# Altium schematic sheet Power.SchDoc
size A4
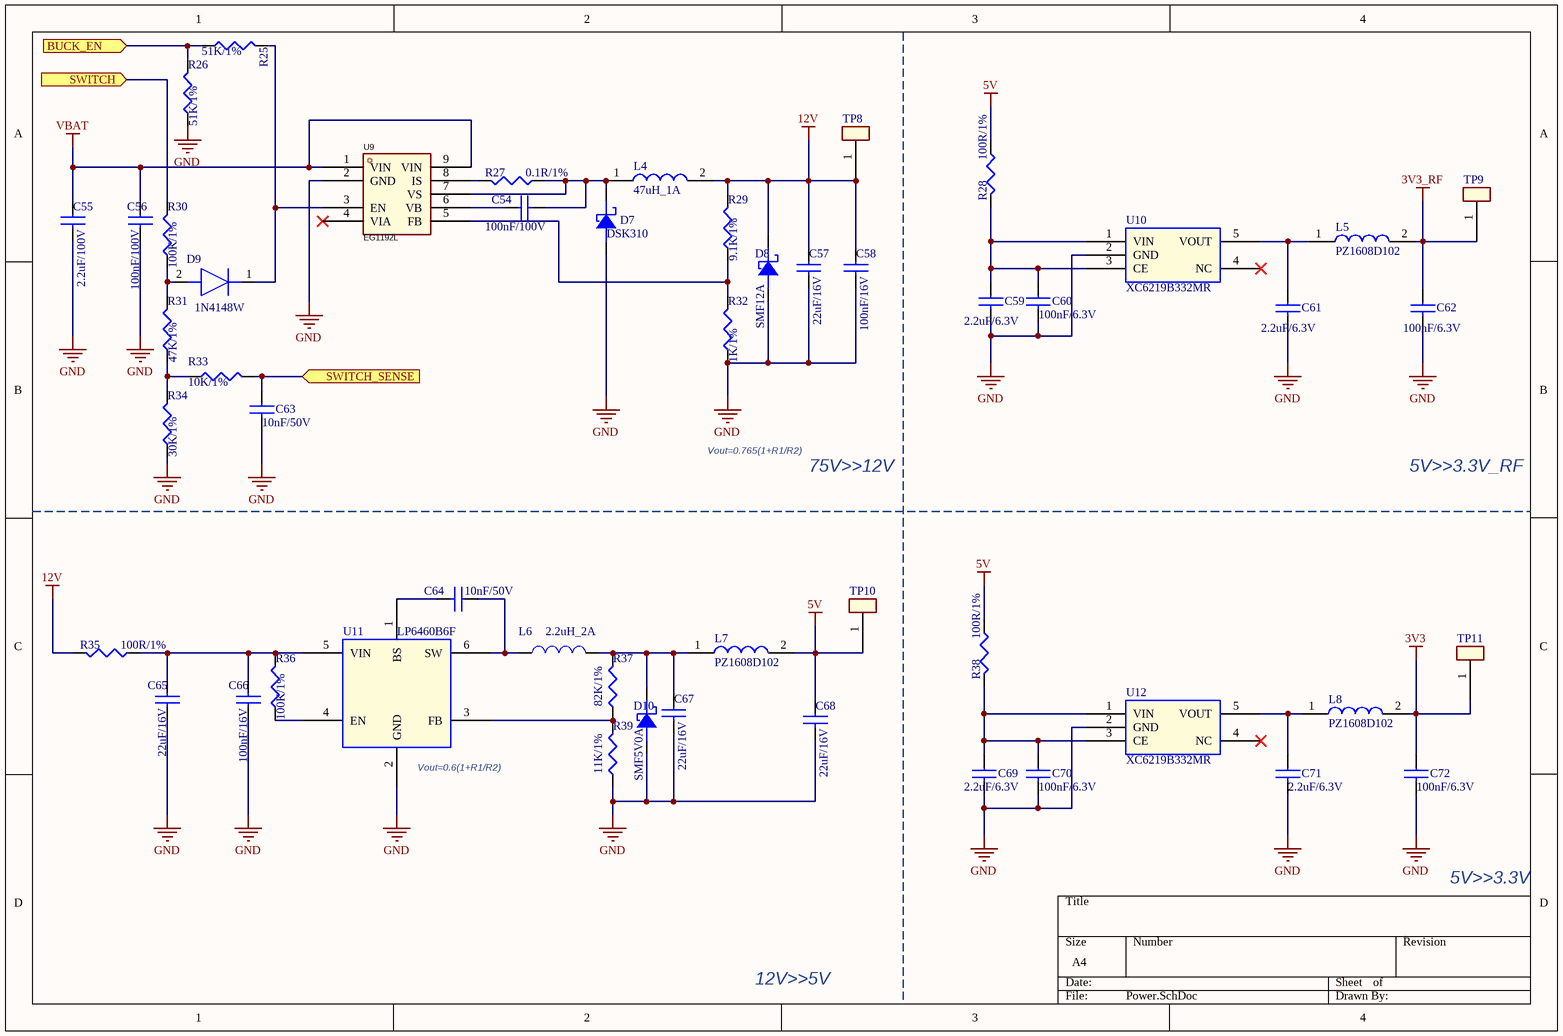
[diagram p0: Power.SchDoc]

## Parts
C54  100nF/100V  [C0603]
C55  2.2uF/100V  [C1206]
C56  100nF/100V  [C0603]
C57  22uF/16V  [C0805]
C58  100nF/16V  [C0805]
C59  2.2uF/6.3V  [C0402]
C60  100nF/6.3V  [C0402]
C61  2.2uF/6.3V  [C0402]
C62  100nF/6.3V  [C0402]
C63  10nF/50V  [C0402]
C64  10nF/50V  [C0402]
C65  22uF/16V  [C0805]
C66  100nF/16V  [C0805]
C67  22uF/16V  [C0805]
C68  22uF/16V  [C0805]
C69  2.2uF/6.3V  [C0402]
C70  100nF/6.3V  [C0402]
C71  2.2uF/6.3V  [C0402]
C72  100nF/6.3V  [C0402]
D7  DSK310  [SOD-123F]
D8  SMF12A  [SOD-123F]
D9  1N4148W  [1N4148WVGS08]
D10  SMF5V0A  [SOD-123F]
L4  47uH_1A  [L5040]
L5  PZ1608D102  [L0603]
L6  2.2uH_2A  [L4020]
L7  PZ1608D102  [L0603]
L8  PZ1608D102  [L0603]
R25  51K/1%  [R0402]
R26  51K/1%  [R0402]
R27  0.1R/1%  [R0603]
R28  100R/1%  [R0603]
R29  9.1K/1%  [R0402]
R30  100K/1%  [R0402]
R31  47K/1%  [R0402]
R32  1K/1%  [R0402]
R33  10K/1%  [R0402]
R34  30K/1%  [R0402]
R35  100R/1%  [R0603]
R36  100K/1%  [R0402]
R37  82K/1%  [R0402]
R38  100R/1%  [R0603]
R39  11K/1%  [R0402]
TP8  TEST POINT  [test_point_100_smd]  (value not drawn)
TP9  TEST POINT  [test_point_100_smd]  (value not drawn)
TP10  TEST POINT  [test_point_100_smd]  (value not drawn)
TP11  TEST POINT  [test_point_100_smd]  (value not drawn)
U9  EG1192L  [ESOP-8_L4.9-W3.9-P1.27-LS6.0-BL-EP-1]
U10  XC6219B332MR  [SOT-23-5]
U11  LP6460B6F  [SOT-23-6]
U12  XC6219B332MR  [SOT-23-5]

## Ports
BUCK_EN (in, see VESC_75100[2C]), SWITCH (in, see VESC_75100[2C]), SWITCH_SENSE (in, see VESC_75100[2C], MCU[1C])

## Nets
3V3: C72.1 L8.2 TP11.1
3V3_RF: C62.1 L5.2 TP9.1
5V: C68.1 L7.2 R28.1 R38.1 TP10.1
12V: C57.1 C58.1 D8.1(K) L4.2 R29.2 R35.2 TP8.1
GND: C55.2 C56.2 C57.2 C58.2 C59.2 C60.2 C61.2 C62.2 C63.2 C65.2 C66.2 C67.2 C68.2 C69.2 C70.2 C71.2 C72.2 D7.2(A) D8.2(A) D10.2(A) R26.1 R32.1 R34.1 R39.1 U9.2(GND) U10.2(GND) U11.2(GND) U12.2(GND)
VBAT: C55.1 C56.1 U9.1(VIN) U9.9(VIN)
BUCK_EN: R25.1 R26.2 ; port BUCK_EN
SWITCH: R30.2 ; port SWITCH
SWITCH_SENSE: C63.1 R33.2 ; port SWITCH_SENSE
NetC54_1: C54.1 U9.6(VB)
NetC54_2: C54.2 D7.1(K) L4.1 R27.1 U9.7(VS)
NetC59_1: C59.1 C60.1 R28.2 U10.1(VIN) U10.3(CE)
NetC61_1: C61.1 L5.1 U10.5(VOUT)
NetC64_1: C64.1 L6.1 U11.6(SW)
NetC64_2: C64.2 U11.1(BS)
NetC65_1: C65.1 C66.1 R35.1 R36.2 U11.5(VIN)
NetC67_1: C67.1 D10.1(K) L6.2 L7.1 R37.2
NetC69_1: C69.1 C70.1 R38.2 U12.1(VIN) U12.3(CE)
NetC71_1: C71.1 L8.1 U12.5(VOUT)
NetD9_1: D9.1(K) R25.2 U9.3(EN)
NetD9_2: D9.2(A) R30.1 R31.2
NetR27_2: R27.2 U9.8(IS)
NetR29_1: R29.1 R32.2 U9.5(FB)
NetR31_1: R31.1 R33.1 R34.2
NetR36_1: R36.1 U11.4(EN)
NetR37_1: R37.1 R39.2 U11.3(FB)

Not connected (* = marked no-connect by the designer): U9 4(VIA)*; U10 4(NC)*; U12 4(NC)*

## Notes on the sheet
- Vout=0.765(1+R1/R2)
- 75V>>12V
- 5V>>3.3V_RF
- (near U11) Vout=0.6(1+R1/R2)
- 5V>>3.3V
- 12V>>5V

## Library data of the parts
C54-C72 = CAP NP
  C54 C56: PCB Footprint: C0603
  C55: PCB Footprint: C1206
  C57 C58 C65-C68: PCB Footprint: C0805
  C59-C64 C69-C72: PCB Footprint: C0402
D7 D8 D10 = DIODE SCHOTTKY21: PCB Footprint: SOD-123F
D9 = 1N4148W-V-GS08: Diode; Manufacturer_Name: Vishay; Datasheet Link: https://us.rs-online.com/m/d/a2789c8794cb0c42ced29f2dd8571f3c.pdf; Height: 1.35mm; Manufacturer_Part_Number: 1N4148W-V-GS08; Mouser Part Number: 625-1N4148W-V; Mouser Price/Stock: https://www.mouser.co.uk/ProductDetail/Vishay-Semiconductors/1N4148W-V-GS08?qs=TNTIDjy6APrS%2Fdgq1RSs3A%3D%3D; Arrow Part Number: 1N4148W-V-GS08; Arrow Price/Stock: https://www.arrow.com/en/products/1n4148w-v-gs08/vishay
L4 = 74404054221: Inductor; Manufacturer_Name: Wurth Elektronik; Datasheet Link: https://www.mouser.com/datasheet/2/445/74404054221-1280555.pdf; Height: 4mm; Manufacturer_Part_Number: 74404054221; Mouser Part Number: 710-74404054221; Mouser Price/Stock: https://www.mouser.co.uk/ProductDetail/Wurth-Elektronik/74404054221?qs=f9yNj16SXrLBSuRgk86STQ%3D%3D
L5 L7 L8 = PZ1608D102: Inductor; Manufacturer_Name: Murata Electronics; Manufacturer_Part_Number: LQG15HS4N7C02D; Datasheet Link: https://search.murata.co.jp/Ceramy/image/img/P02/JELF243B-0010.pdf; Height: 0.6mm; Mouser Part Number: 81-LQG15HS4N7C02D; Mouser Price/Stock: https://www.mouser.co.uk/ProductDetail/Murata-Electronics/LQG15HS4N7C02D?qs=60uY6ySkanQsgm4t8ngjFA%3D%3D; Arrow Part Number: LQG15HS4N7C02D; Arrow Price/Stock: https://www.arrow.com/en/products/lqg15hs4n7c02d/murata-manufacturing
L6 = INDUCTOR: PCB Footprint: L4020
R25 R26 R29-R34 R36 R37 R39 = RESISTOR: PCB Footprint: R0402
R27 R28 R35 R38 = RESISTOR: PCB Footprint: R0402
U9 = EG1192L: Manufacturer: EG(屹晶微); Manufacturer Part: EG1198; Symbol: EG1192; Add into BOM: yes; Function: 降压型; Input Voltage: 10V~120V; Output Current: 1.5A; Switching Frequency: 120kHz; Number of Outputs: 1; Topology: 降压式; Switch tube (built-in/external): 内置; Device: EG1192; LCSC Part Name: 高性价比宽电压降压DCDC电源芯片; Supplier Part: C2987436; Supplier Footprint: ESOP-8; JLCPCB Part Class: Extended Part; Datasheet: https://atta.szlcsc.com/upload/public/pdf/source/20211208/030CAF1F902F9A81F24E8BE238D4FEDC.pdf; Supplier: LCSC; Convert to PCB: yes; Output Type: -; Output Voltage: -; Operating Temperature: -45℃~+125℃; Synchronous Rectification: -; Quiescent Current (Iq): -
U10 U12 = XC6219B332MR: PCB Footprint: SOT-23-5
U11 = LP6460B6F: PCB Footprint: SOT-23-6